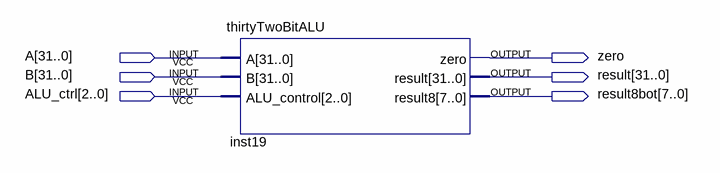
[diagram p0: schematic sheet]
// Quartus schematic testing_alu.bdf as structural Verilog: 1 symbols, 6 pins
module testing_alu (
  input  [31:0] A,
  input  [31:0] B,
  input  [2:0] ALU_ctrl,
  output zero,
  output [31:0] result,
  output [7:0] result8bot
);

  thirtyTwoBitALU inst19 (.A(A), .B(B), .ALU_control(ALU_ctrl), .zero(zero), .result(result), .result8(result8bot));
endmodule
